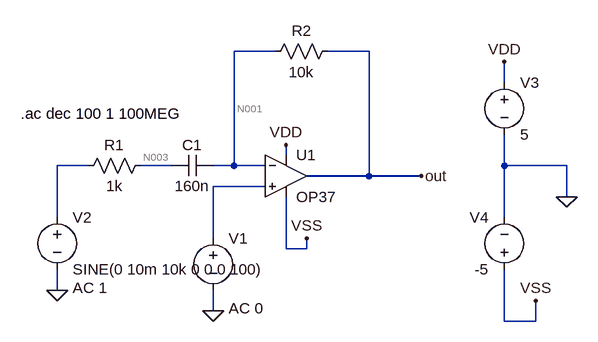
[diagram p0: schematic Draft1.asc]
Draft1.asc, the LTspice schematic file:
Version 4
SHEET 1 880 680
WIRE 144 32 80 32
WIRE 288 32 224 32
WIRE 496 80 496 48
WIRE 160 192 160 176
WIRE -144 208 -192 208
WIRE -16 208 -64 208
WIRE 80 208 80 32
WIRE 80 208 48 208
WIRE 128 208 80 208
WIRE 496 208 496 160
WIRE 592 208 496 208
WIRE 288 224 288 32
WIRE 288 224 192 224
WIRE 368 224 288 224
WIRE 128 240 48 240
WIRE 592 256 592 208
WIRE -192 288 -192 208
WIRE 496 288 496 208
WIRE 48 320 48 240
WIRE 160 336 160 256
WIRE 192 336 192 320
WIRE 192 336 160 336
WIRE -192 400 -192 368
WIRE 48 432 48 400
WIRE 496 448 496 368
WIRE 544 448 544 416
WIRE 544 448 496 448
FLAG -192 400 0
FLAG 48 432 0
FLAG 592 256 0
FLAG 160 176 VDD
FLAG 496 48 VDD
FLAG 192 320 VSS
FLAG 544 416 VSS
FLAG 368 224 out
SYMBOL res -48 192 R90
WINDOW 0 0 56 VBottom 2
WINDOW 3 32 56 VTop 2
SYMATTR InstName R1
SYMATTR Value 1k
SYMBOL res 240 16 R90
WINDOW 0 0 56 VBottom 2
WINDOW 3 32 56 VTop 2
SYMATTR InstName R2
SYMATTR Value 10k
SYMBOL voltage 48 304 R0
WINDOW 123 24 124 Left 2
WINDOW 39 0 0 Left 2
SYMATTR InstName V1
SYMATTR Value ""
SYMATTR Value2 AC 0
SYMBOL voltage -192 272 R0
WINDOW 123 24 124 Left 2
WINDOW 39 0 0 Left 2
SYMATTR InstName V2
SYMATTR Value SINE(0 10m 10k 0 0 0 100)
SYMATTR Value2 AC 1
SYMBOL Opamps\\OP37 160 160 R0
SYMATTR InstName U1
SYMBOL voltage 496 64 R0
WINDOW 123 0 0 Left 2
WINDOW 39 0 0 Left 2
SYMATTR InstName V3
SYMATTR Value 5
SYMBOL voltage 496 384 R180
WINDOW 0 24 96 Left 2
WINDOW 3 24 16 Left 2
WINDOW 123 0 0 Left 2
WINDOW 39 0 0 Left 2
SYMATTR InstName V4
SYMATTR Value -5
SYMBOL cap 48 192 R90
WINDOW 0 0 32 VBottom 2
WINDOW 3 32 32 VTop 2
SYMATTR InstName C1
SYMATTR Value 160n
TEXT -248 128 Left 2 !.ac dec 100 1 100MEG

The netlist it stands for:
* Draft1.asc
R1 N003 N002 1k
R2 out N001 10k
V1 N004 0 AC 0
V2 N002 0 SINE(0 10m 10k 0 0 0 100) AC 1
XU1 N004 N001 VDD VSS out LT1037  ; OP37, pins In+ In- V+ V- OUT
V3 VDD 0 5
V4 VSS 0 -5
C1 N001 N003 160n
.ac dec 100 1 100MEG
.lib LTC.lib
.backanno
.end

* Results of the author's LTspice run, read from the files saved beside the schematic
* Operating Point, zero values left out:
*   V(vdd) = 5 V
*   V(vss) = -5 V
*   I(V4) = 2.666 mA
*   I(V3) = -2.666 mA
*   Ix(u1:3) = 2.666 mA
*   Ix(u1:4) = -2.666 mA
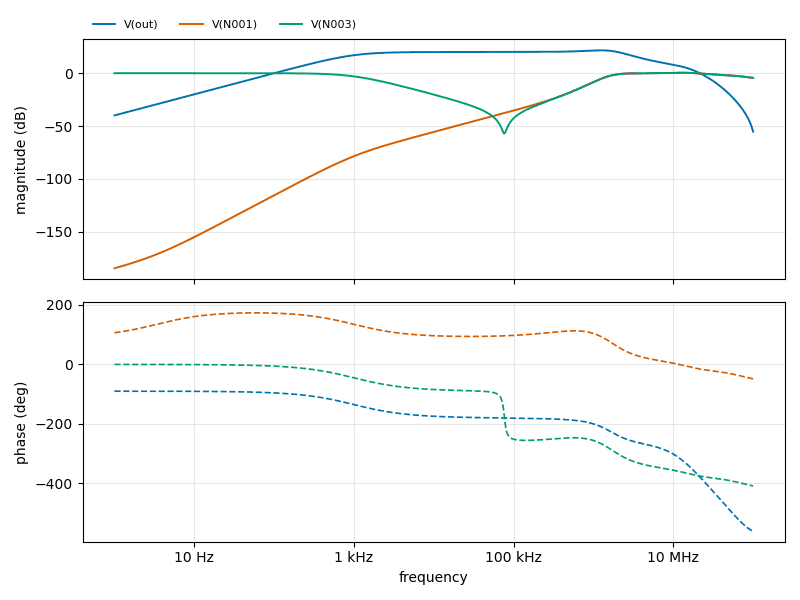
[diagram p1: AC Analysis of Draft1.asc, plotted from the saved traces]
* AC Analysis, 1 run:
*   V(out): -39.95 dB at 1 Hz, -55.35 dB at 100 MHz, peak 21.60 dB at 1.259 MHz, 3 dB below the peak at 1.608 kHz and 2.414 MHz
*   V(N001): -184.54 dB at 1 Hz, -4.46 dB at 100 MHz, peak 0.42 dB at 12.59 MHz, 3 dB below the peak at 1.59 MHz and 61.07 MHz
*   V(N003): -0.00 dB at 1 Hz, -4.46 dB at 100 MHz, peak 0.42 dB at 12.59 MHz, 3 dB below the peak at 1.591 MHz and 61.07 MHz